# EAGLE schematic Controller (EAGLE 7.2.0)
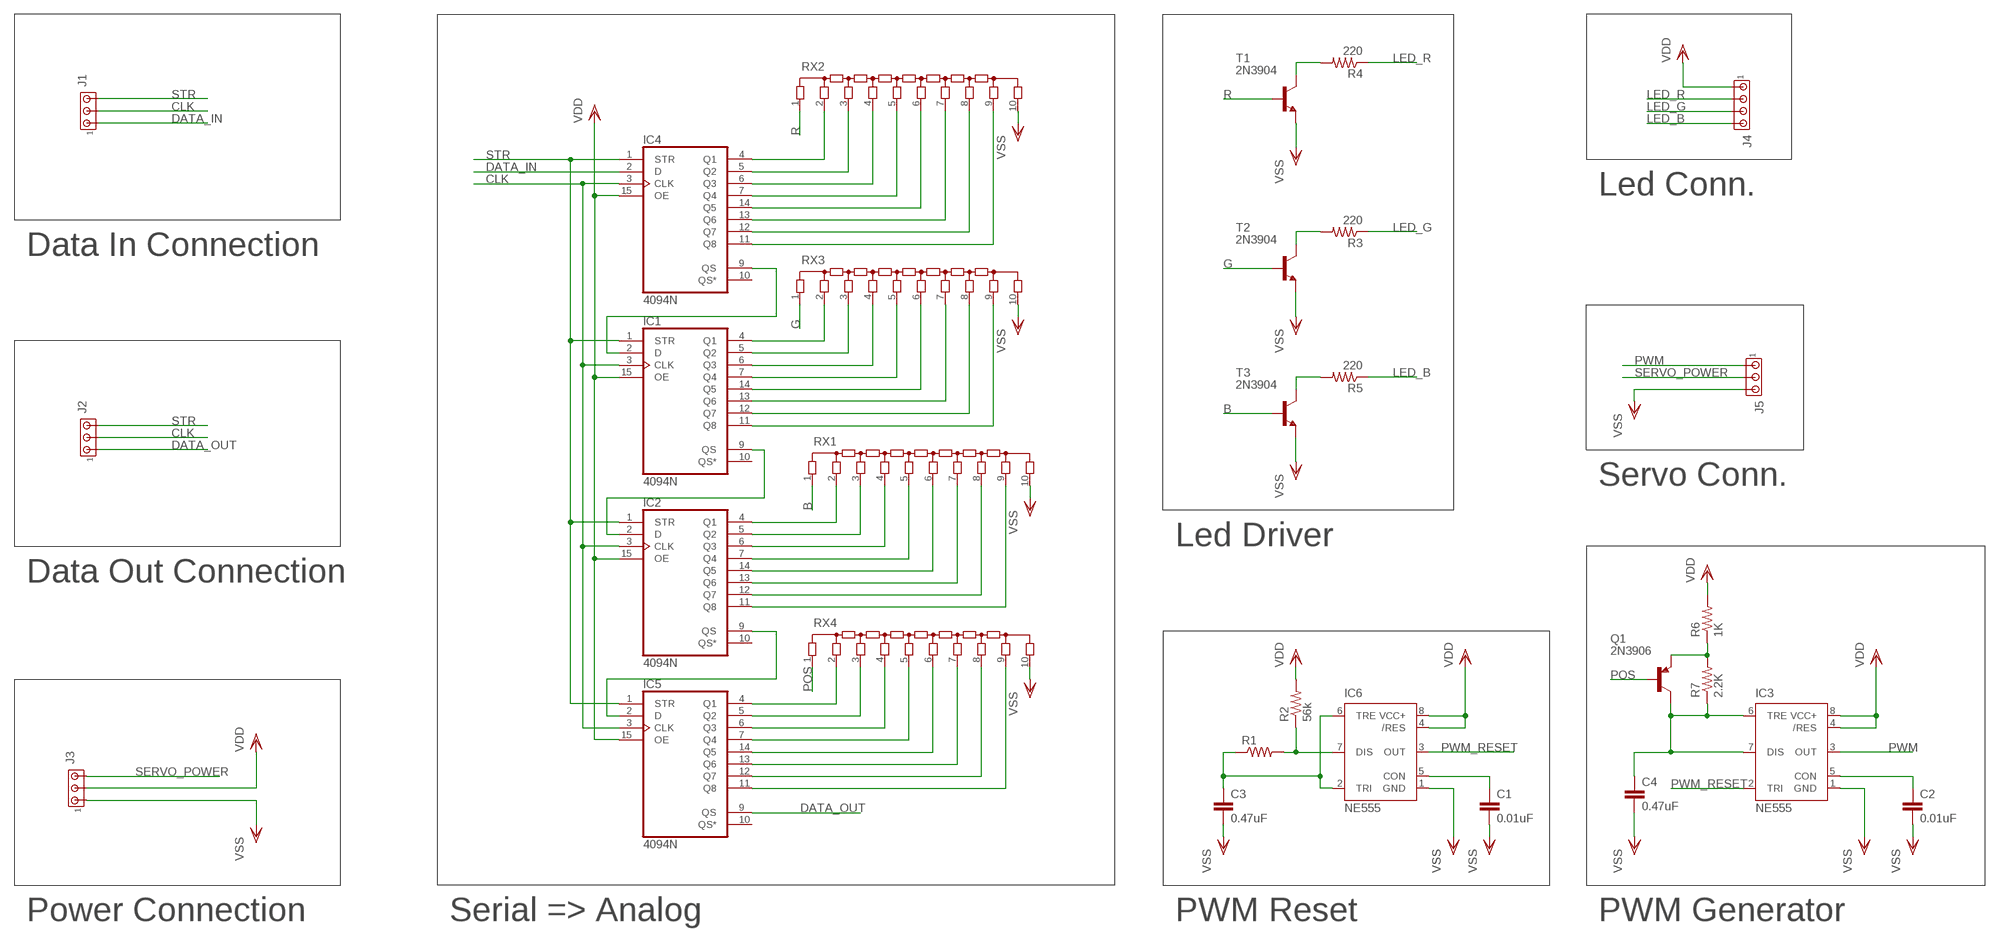
[diagram p0: schematic, sheet 1]

## Parts
C1  0.01uF  C5/2.5  [C5B2.5]
C2  0.01uF  C5/2.5  [C5B2.5]
C3  0.47uF  C5/2.5  [C5B2.5]
C4  0.47uF  C5/2.5  [C5B2.5]
IC1  4094N  [DIL16]
IC2  4094N  [DIL16]
IC3  NE555  [DIL-08]
IC4  4094N  [DIL16]
IC5  4094N  [DIL16]
IC6  NE555  [DIL-08]
J1  MTA03-100  [10X03MTA]
J2  MTA03-100  [10X03MTA]
J3  MTA03-100  [10X03MTA]
J4  MTA04-100  [10X04MTA]
J5  MTA03-100  [10X03MTA]
Q1  2N3906  [TO92]
R1  R-US_0207/7  [0207/7]
R2  56k  R-US_0207/7  [0207/7]
R3  220  R-US_0207/7  [0207/7]
R4  220  R-US_0207/7  [0207/7]
R5  220  R-US_0207/7  [0207/7]
R6  1K  R-US_0207/7  [0207/7]
R7  2.2K  R-US_0207/7  [0207/7]
RX1  R/2R-8  [SIL10]
RX2  R/2R-8  [SIL10]
RX3  R/2R-8  [SIL10]
RX4  R/2R-8  [SIL10]
T1  2N3904  [TO92]
T2  2N3904  [TO92]
T3  2N3904  [TO92]

## Nets
B: RX1.1(IN) T3.2(B)
CLK: IC1.3(CLK) IC2.3(CLK) IC4.3(CLK) IC5.3(CLK) J1.2 J2.2
DATA_IN: IC4.2(D) J1.1
DATA_OUT: IC5.9(QS) J2.1
G: RX3.1(IN) T2.2(B)
LED_B: J4.4 R5.1
LED_G: J4.3 R3.1
LED_R: J4.2 R4.1
N$1: IC1.4(Q1) RX3.2(B8)
N$2: IC1.5(Q2) RX3.3(B7)
N$3: IC1.6(Q3) RX3.4(B6)
N$4: IC1.7(Q4) RX3.5(B5)
N$5: IC1.14(Q5) RX3.6(B4)
N$6: IC1.13(Q6) RX3.7(B3)
N$7: IC1.12(Q7) RX3.8(B2)
N$8: IC1.11(Q8) RX3.9(B1)
N$9: IC2.4(Q1) RX1.2(B8)
N$10: IC2.5(Q2) RX1.3(B7)
N$11: IC2.6(Q3) RX1.4(B6)
N$12: IC2.7(Q4) RX1.5(B5)
N$13: IC2.14(Q5) RX1.6(B4)
N$14: IC2.13(Q6) RX1.7(B3)
N$15: IC2.12(Q7) RX1.8(B2)
N$16: IC2.11(Q8) RX1.9(B1)
N$17: IC5.4(Q1) RX4.2(B8)
N$18: IC5.5(Q2) RX4.3(B7)
N$19: IC5.6(Q3) RX4.4(B6)
N$20: IC5.7(Q4) RX4.5(B5)
N$21: IC5.14(Q5) RX4.6(B4)
N$22: IC5.13(Q6) RX4.7(B3)
N$23: IC5.12(Q7) RX4.8(B2)
N$24: IC5.11(Q8) RX4.9(B1)
N$25: IC2.9(QS) IC5.2(D)
N$26: IC1.9(QS) IC2.2(D)
N$27: IC1.2(D) IC4.9(QS)
N$30: IC4.4(Q1) RX2.2(B8)
N$31: IC4.5(Q2) RX2.3(B7)
N$32: IC4.6(Q3) RX2.4(B6)
N$33: IC4.7(Q4) RX2.5(B5)
N$34: IC4.14(Q5) RX2.6(B4)
N$35: IC4.13(Q6) RX2.7(B3)
N$36: IC4.12(Q7) RX2.8(B2)
N$37: IC4.11(Q8) RX2.9(B1)
N$39: R5.2 T3.1(C)
N$40: R3.2 T2.1(C)
N$41: R4.2 T1.1(C)
N$42: Q1.3(E) R6.1 R7.2
N$43: IC6.7(DIS) R1.2 R2.1
N$44: C3.1 IC6.2(TRI) IC6.6(TRE) R1.1
N$45: C1.1 IC6.5(CON)
N$46: C2.1 IC3.5(CON)
N$47: C4.1 IC3.6(TRE) IC3.7(DIS) Q1.1(C) R7.1
POS: Q1.2(B) RX4.1(IN)
PWM: IC3.3(OUT) J5.1
PWM_RESET: IC3.2(TRI) IC6.3(OUT)
R: RX2.1(IN) T1.2(B)
SERVO_POWER: J3.3 J5.2
STR: IC1.1(STR) IC2.1(STR) IC4.1(STR) IC5.1(STR) J1.3 J2.3
VDD: IC1.15(OE) IC2.15(OE) IC3.4(/RES) IC3.8(VCC+) IC4.15(OE) IC5.15(OE) IC6.4(/RES) IC6.8(VCC+) J3.2 J4.1 R2.2 R6.2
VSS: C1.2 C2.2 C3.2 C4.2 IC3.1(GND) IC6.1(GND) J3.1 J5.3 RX1.10(OUT) RX2.10(OUT) RX3.10(OUT) RX4.10(OUT) T1.3(E) T2.3(E) T3.3(E)
Unconnected: IC1.10(QS*) IC2.10(QS*) IC4.10(QS*) IC5.10(QS*)

## Notes on the sheet
- Led Conn.
- Data In Connection
- Servo Conn.
- Led Driver
- Data Out Connection
- Power Connection | Serial => Analog | PWM Reset | PWM Generator

## Power pins joined to a net without a drawn wire
VDD: IC1.16(VDD) IC2.16(VDD) IC4.16(VDD) IC5.16(VDD)
VSS: IC1.8(VSS) IC2.8(VSS) IC4.8(VSS) IC5.8(VSS)

## Library data of the parts
C1-C4 = capacitor-wima:C: CAPACITOR naming: grid - package width
IC1 IC2 IC4 IC5 = 40xx:4094: 8-stage SHIFT/STORE REGISTER, tri-state
IC3 IC6 = st-microelectronics:NE555: General purpose bipolar Timer; MF: Arrow Electronics; MPN: NE555N; OC_FARNELL: 1467742; OC_NEWARK: 89K1486
J1-J3 J5 = con-amp:MTA03-100: AMP connector
J4 = con-amp:MTA04-100: AMP connector
Q1 = transistor-pnp:2N3906: PNP Transistor
R1-R7 = rcl:R-US_: RESISTOR, American symbol
RX1-RX4 = resistor-sil:R/2R-8: R/2R Ladder 8 Murata RGSD16L; OC_FARNELL: unknown; OC_NEWARK: unknown
T1-T3 = transistor:2N3904: NPN TRANSISTOR